# EAGLE design balise réceptrice - partie filtrage (EAGLE 6.3)
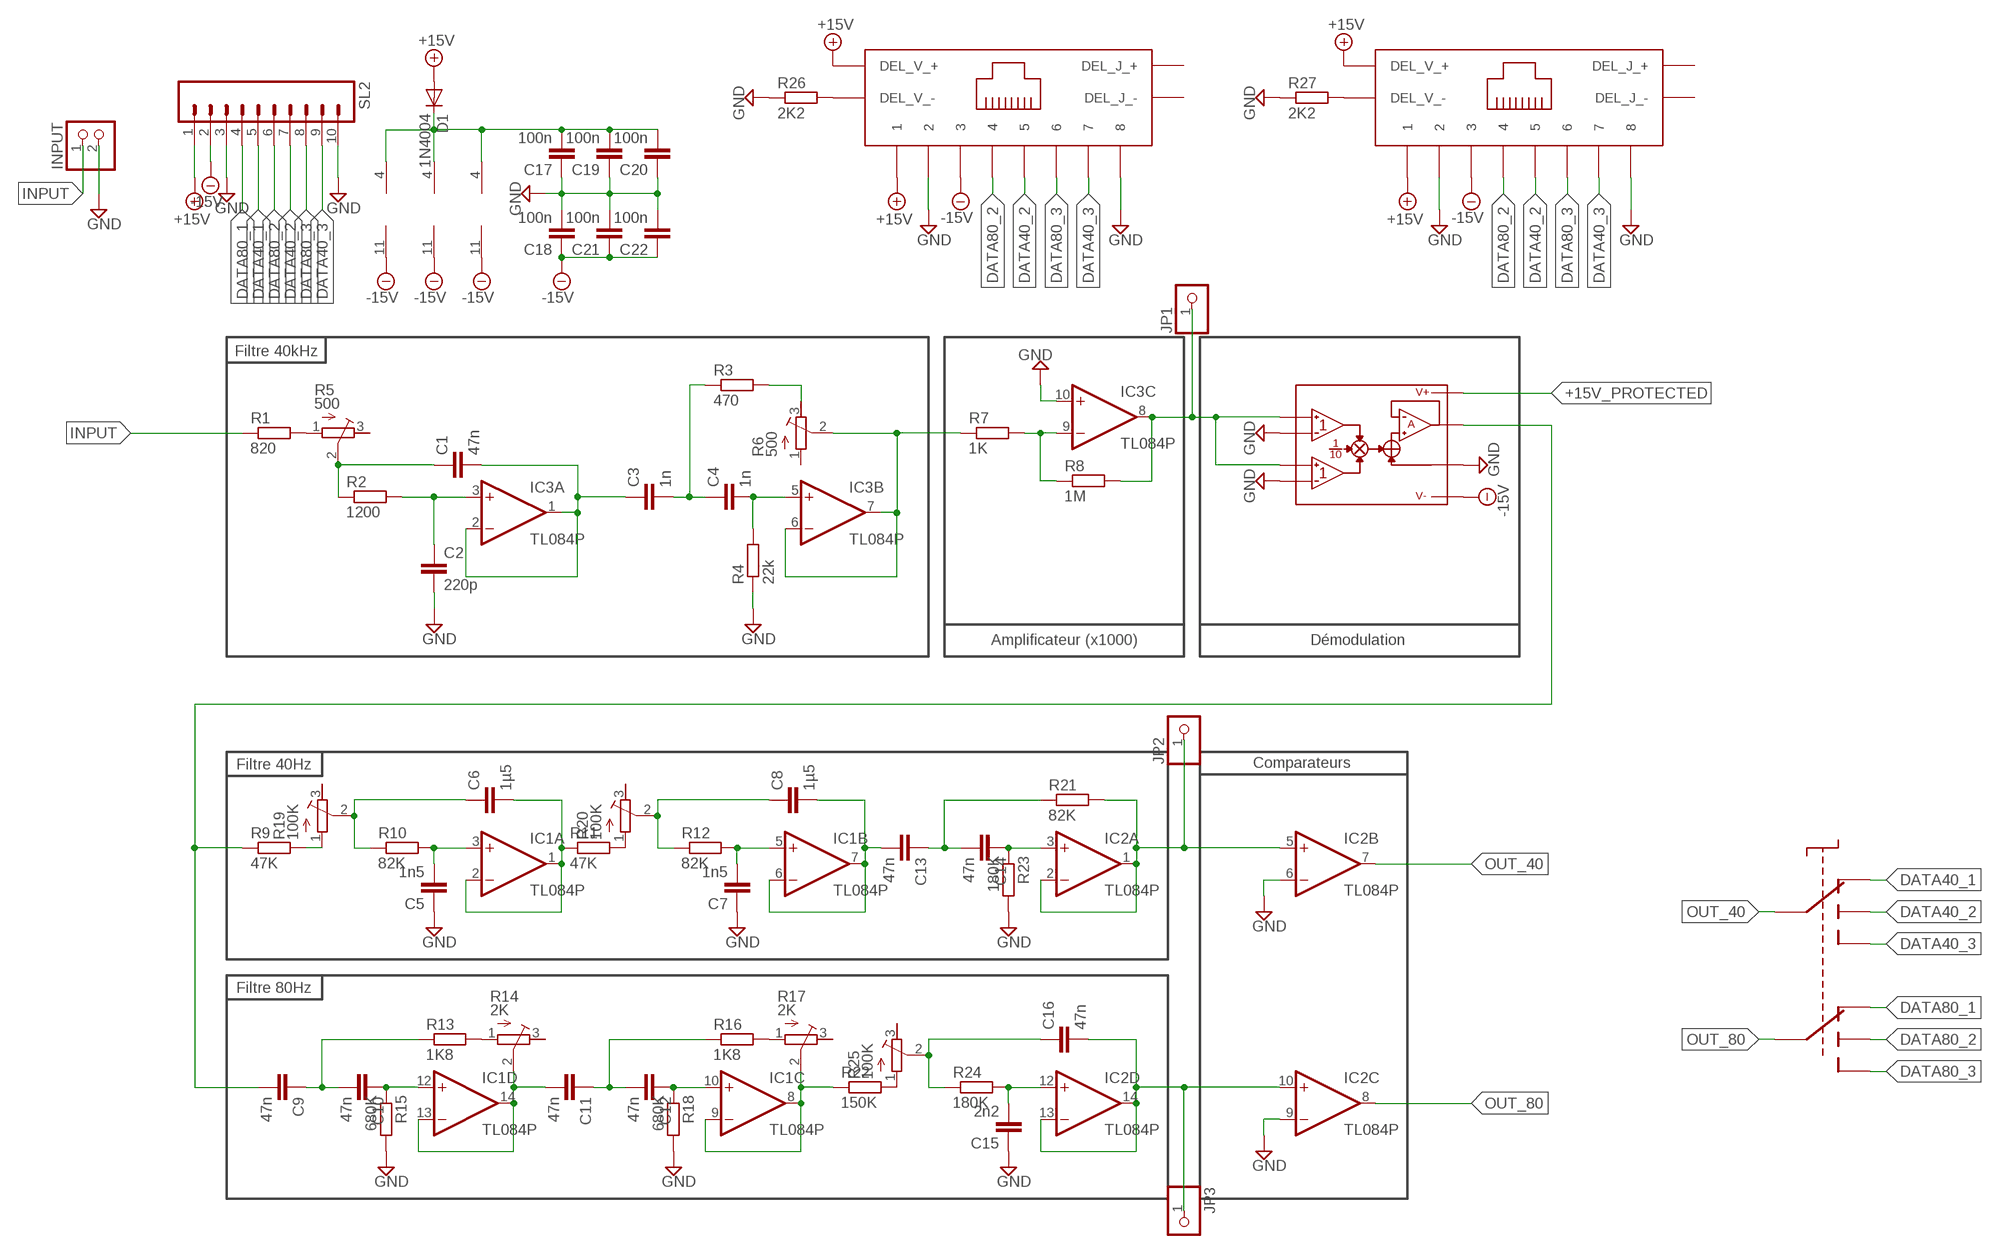
[diagram p0: schematic, sheet 1]

## Parts
C1  47n  C-EU050-024X044  [C050-024X044]
C2  220p  C-EU050-024X044  [C050-024X044]
C3  1n  C-EU050-024X044  [C050-024X044]
C4  1n  C-EU050-024X044  [C050-024X044]
C5  1n5  C-EU050-024X044  [C050-024X044]
C6  1µ5  C-EU150-091X182  [C150-091X182]
C7  1n5  C-EU050-024X044  [C050-024X044]
C8  1µ5  C-EU150-091X182  [C150-091X182]
C9  47n  C-EU050-024X044  [C050-024X044]
C10  47n  C-EU050-024X044  [C050-024X044]
C11  47n  C-EU050-024X044  [C050-024X044]
C12  47n  C-EU050-024X044  [C050-024X044]
C13  47n  C-EU050-024X044  [C050-024X044]
C14  47n  C-EU050-024X044  [C050-024X044]
C15  2n2  C-EU050-024X044  [C050-024X044]
C16  47n  C-EU050-024X044  [C050-024X044]
C17  100n  C-EU050-024X044  [C050-024X044]
C18  100n  C-EU050-024X044  [C050-024X044]
C19  100n  C-EU050-024X044  [C050-024X044]
C20  100n  C-EU050-024X044  [C050-024X044]
C21  100n  C-EU050-024X044  [C050-024X044]
C22  100n  C-EU050-024X044  [C050-024X044]
D1  1N4004  [DO41-10]
IC1  TL084P  [DIL14]
IC2  TL084P  [DIL14]
IC3  TL084P  [DIL14]
INPUT  PINHD-1X2  [1X02]
JP1  PINHD-1X1  [1X01]
JP2  PINHD-1X1  [1X01]
JP3  PINHD-1X1  [1X01]
R1  820  R-EU_0207/2V  [0207/2V]
R2  1200  R-EU_0207/2V  [0207/2V]
R3  470  R-EU_0207/2V  [0207/2V]
R4  22k  R-EU_0207/2V  [0207/2V]
R5  500  R-TRIMM3339P  [RTRIM3339P]
R6  500  R-TRIMM3339P  [RTRIM3339P]
R7  1K  R-EU_0204/7  [0204/7]
R8  1M  R-EU_0204/7  [0204/7]
R9  47K  R-EU_0204/7  [0204/7]
R10  82K  R-EU_0204/7  [0204/7]
R11  47K  R-EU_0207/2V  [0207/2V]
R12  82K  R-EU_0207/2V  [0207/2V]
R13  1K8  R-EU_0207/2V  [0207/2V]
R14  2K  R-TRIMM3339P  [RTRIM3339P]
R15  680K  R-EU_0207/2V  [0207/2V]
R16  1K8  R-EU_0207/2V  [0207/2V]
R17  2K  R-TRIMM3339P  [RTRIM3339P]
R18  680K  R-EU_0207/2V  [0207/2V]
R19  100K  R-TRIMM3339P  [RTRIM3339P]
R20  100K  R-TRIMM3339P  [RTRIM3339P]
R21  82K  R-EU_0207/2V  [0207/2V]
R22  150K  R-EU_0207/2V  [0207/2V]
R23  180K  R-EU_0207/2V  [0207/2V]
R24  180K  R-EU_0207/2V  [0207/2V]
R25  100K  R-TRIMM3339P  [RTRIM3339P]
R26  2K2  R-EU_0207/2V  [0207/2V]
R27  2K2  R-EU_0207/2V  [0207/2V]
SL2  M10  [10P]
U$1  AD633JN  [DIL08]
U$2  RJ45_FEMELLE  [RJ45_FEMELLE]
U$3  RJ45_FEMELLE  [RJ45_FEMELLE]
U$4  SWITCH_DP3T_SP112  [SWITCH_SP112]

## Nets
+15V: D1.A SL2.1 U$2.1 U$2.DEL_V_+ U$3.1 U$3.DEL_V_+
+15V_PROTECTED: C17.2 C19.2 C20.2 D1.C IC1.4(P:V+) IC2.4(P:V+) IC3.4(P:V+) U$1.8(+V)
-15V: C18.1 C21.1 C22.1 IC1.11(P:V-) IC2.11(P:V-) IC3.11(P:V-) SL2.2 U$1.5(-V) U$2.3 U$3.3
DATA40_1: SL2.5 U$4.1A
DATA40_2: SL2.7 U$2.5 U$3.5 U$4.1B
DATA40_3: SL2.9 U$2.7 U$3.7 U$4.1C
DATA80_1: SL2.4 U$4.2A
DATA80_2: SL2.6 U$2.4 U$3.4 U$4.2B
DATA80_3: SL2.8 U$2.6 U$3.6 U$4.2C
GND: C2.2 C5.1 C7.1 C15.1 C17.1 C18.2 C19.1 C20.1 C21.2 C22.2 IC2.6(B:-IN) IC2.9(C:-IN) IC3.10(C:+IN) INPUT.2 R4.1 R15.2 R18.2 R23.2 R26.1 R27.1 SL2.3 SL2.10 U$1.2(X2) U$1.4(Y2) U$1.6(Z) U$2.2 U$2.8 U$3.2 U$3.8
INPUT: INPUT.1 R1.1
N$1: C2.1 IC3.3(A:+IN) R2.2
N$2: IC3.9(C:-IN) R7.2 R8.1
N$3: IC3.8(C:OUT) JP1.1 R8.2 U$1.1(X1) U$1.3(Y1)
N$4: R1.2 R5.1(E)
N$5: C1.1 R2.1 R5.2(S)
N$6: C1.2 C3.1 IC3.1(A:OUT) IC3.2(A:-IN)
N$7: C3.2 C4.1 R3.1
N$8: C4.2 IC3.5(B:+IN) R4.2
N$9: IC3.6(B:-IN) IC3.7(B:OUT) R6.2(S) R7.1
N$10: R3.2 R6.3(A)
N$11: R26.2 U$2.DEL_V_-
N$12: C6.1 R10.1 R19.2(S)
N$13: C5.2 IC1.3(A:+IN) R10.2
N$14: C6.2 IC1.1(A:OUT) IC1.2(A:-IN) R11.1
N$15: R13.2 R14.1(E)
N$16: C8.1 R12.1 R20.2(S)
N$17: C7.2 IC1.5(B:+IN) R12.2
N$18: C8.2 C13.2 IC1.6(B:-IN) IC1.7(B:OUT)
N$19: C9.1 C10.2 R13.1
N$20: C11.2 IC1.13(D:-IN) IC1.14(D:OUT) R14.2(S)
N$21: C10.1 IC1.12(D:+IN) R15.1
N$22: R16.2 R17.1(E)
N$23: C11.1 C12.2 R16.1
N$24: IC1.8(C:OUT) IC1.9(C:-IN) R17.2(S) R22.1
N$25: C12.1 IC1.10(C:+IN) R18.1
N$26: C9.2 R9.1 U$1.7(W)
N$27: R9.2 R19.1(E)
N$28: R11.2 R20.1(E)
N$29: C16.1 R24.1 R25.2(S)
N$30: C15.2 IC2.12(D:+IN) R24.2
N$31: C13.1 C14.2 R21.1
N$32: IC2.1(A:OUT) IC2.2(A:-IN) IC2.5(B:+IN) JP2.1 R21.2
N$33: C14.1 IC2.3(A:+IN) R23.1
N$34: C16.2 IC2.10(C:+IN) IC2.13(D:-IN) IC2.14(D:OUT) JP3.1
N$35: R22.2 R25.1(E)
N$36: R27.2 U$3.DEL_V_-
OUT_40: IC2.7(B:OUT) U$4.COM_1(COM1)
OUT_80: IC2.8(C:OUT) U$4.COM_2(COM2)
Unconnected: IC3.12(D:+IN) IC3.13(D:-IN) IC3.14(D:OUT) R5.3(A) R6.1(E) R14.3(A) R17.3(A) R19.3(A) R20.3(A) R25.3(A) U$2.DEL_J_+ U$2.DEL_J_- U$3.DEL_J_+ U$3.DEL_J_-

## Notes on the sheet
- Filtre 40kHz
- Amplificateur (x1000) | Démodulation
- Filtre 40Hz | Comparateurs
- Filtre 80Hz

## Library data of the parts
C1 C3-C22 = resistor:C-EU: CAPACITOR, European symbol; OC_FARNELL: unknown
C2 = resistor:C-EU: CAPACITOR, European symbol; MF: SUSUMU; MPN: RR1220P-104-B-T5; OC_FARNELL: 1653285
D1 = diode:1N4004: DIODE general purpose rectifier, 1 A; OC_FARNELL: unknown
IC1-IC3 = linear:TL084: OP AMP; OC_FARNELL: unknown
INPUT = pinhead:PINHD-1X2: PIN HEADER; OC_FARNELL: unknown
JP1-JP3 = pinhead:PINHD-1X1: PIN HEADER; OC_FARNELL: unknown
R1-R4 R7-R13 R15 R16 R18 R21-R24 R26 R27 = resistor:R-EU_: RESISTOR, European symbol; OC_FARNELL: unknown
R5 R6 R14 R17 R19 R20 R25 = resistor:R-TRIMM: Trimm resistor; OC_FARNELL: unknown
SL2 = con-amp-quick:M10: AMP QUICK CONNECTOR; OC_FARNELL: unknown; OC_NEWARK: unknown
U$1 = analog-devices:AD633JN; OC_FARNELL: unknown
U$2 U$3 = libINTech-Balise:RJ45_FEMELLE; OC_FARNELL: unknown
U$4 = libINTech-Balise:SWITCH_DP3T_SP112; OC_FARNELL: unknown

## Board
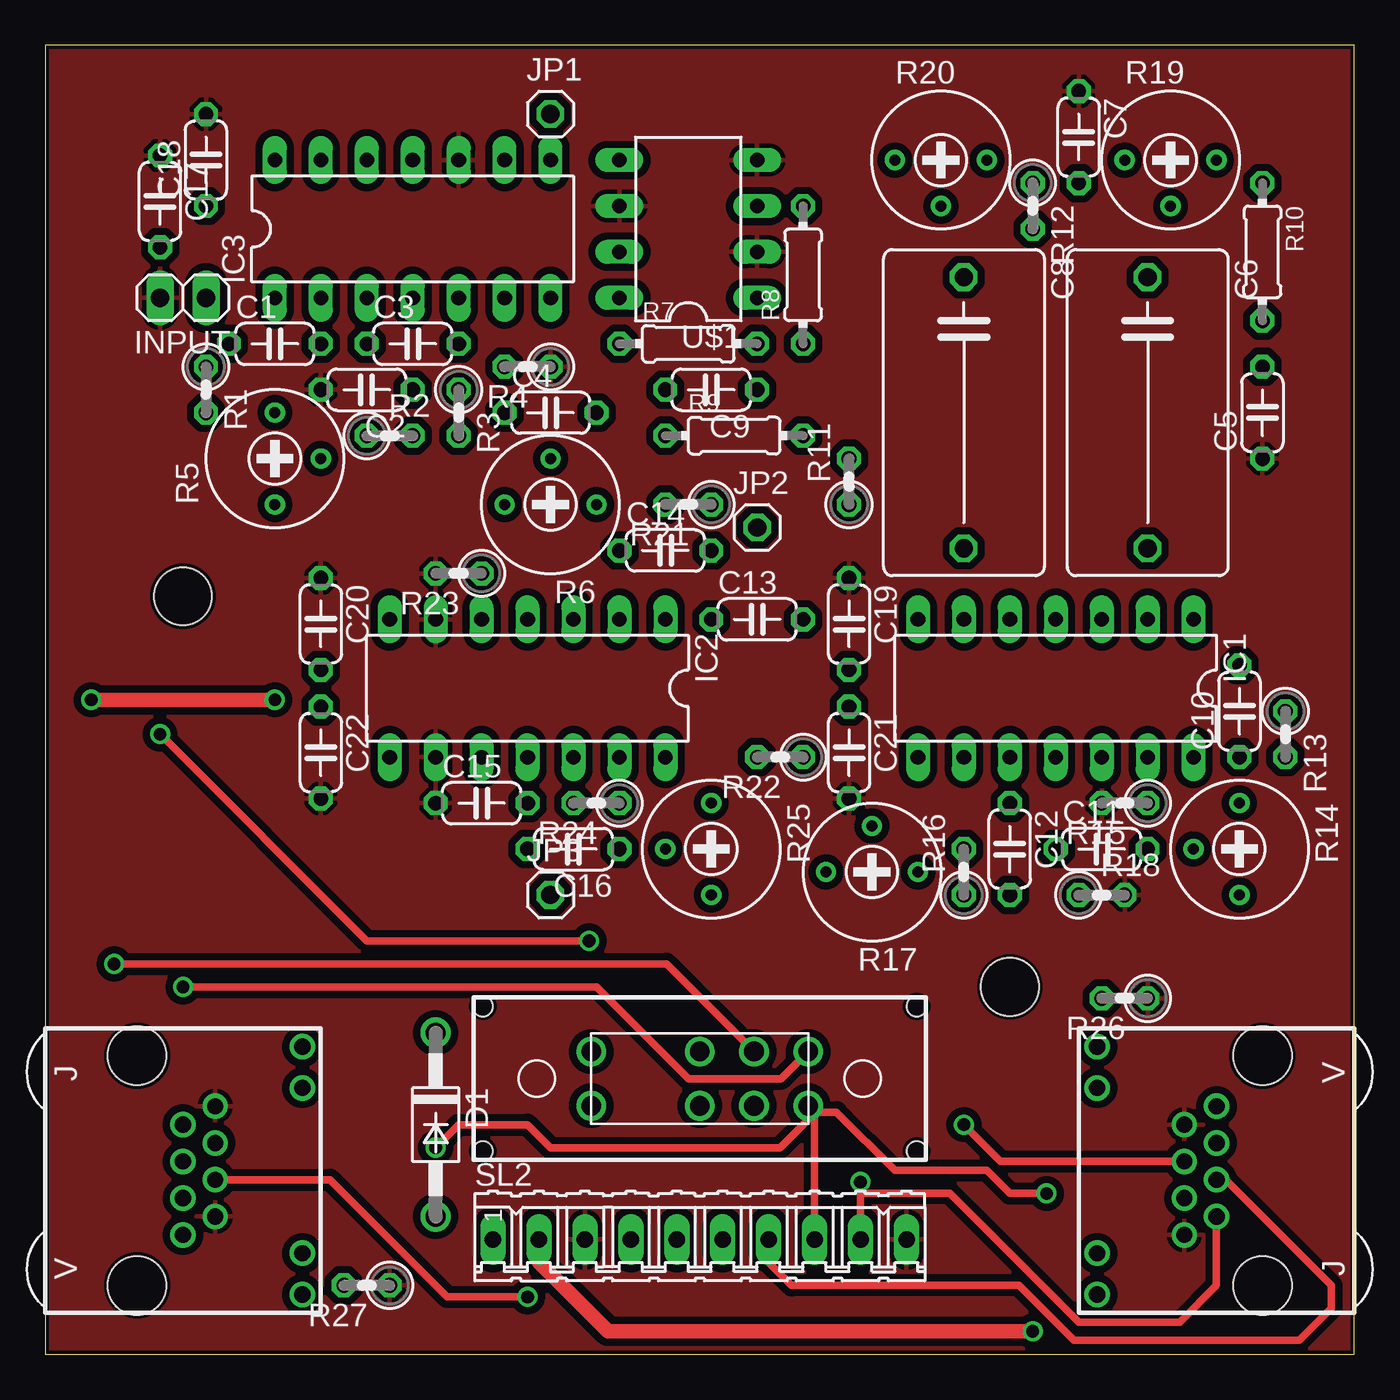
[diagram p1: board, top side]
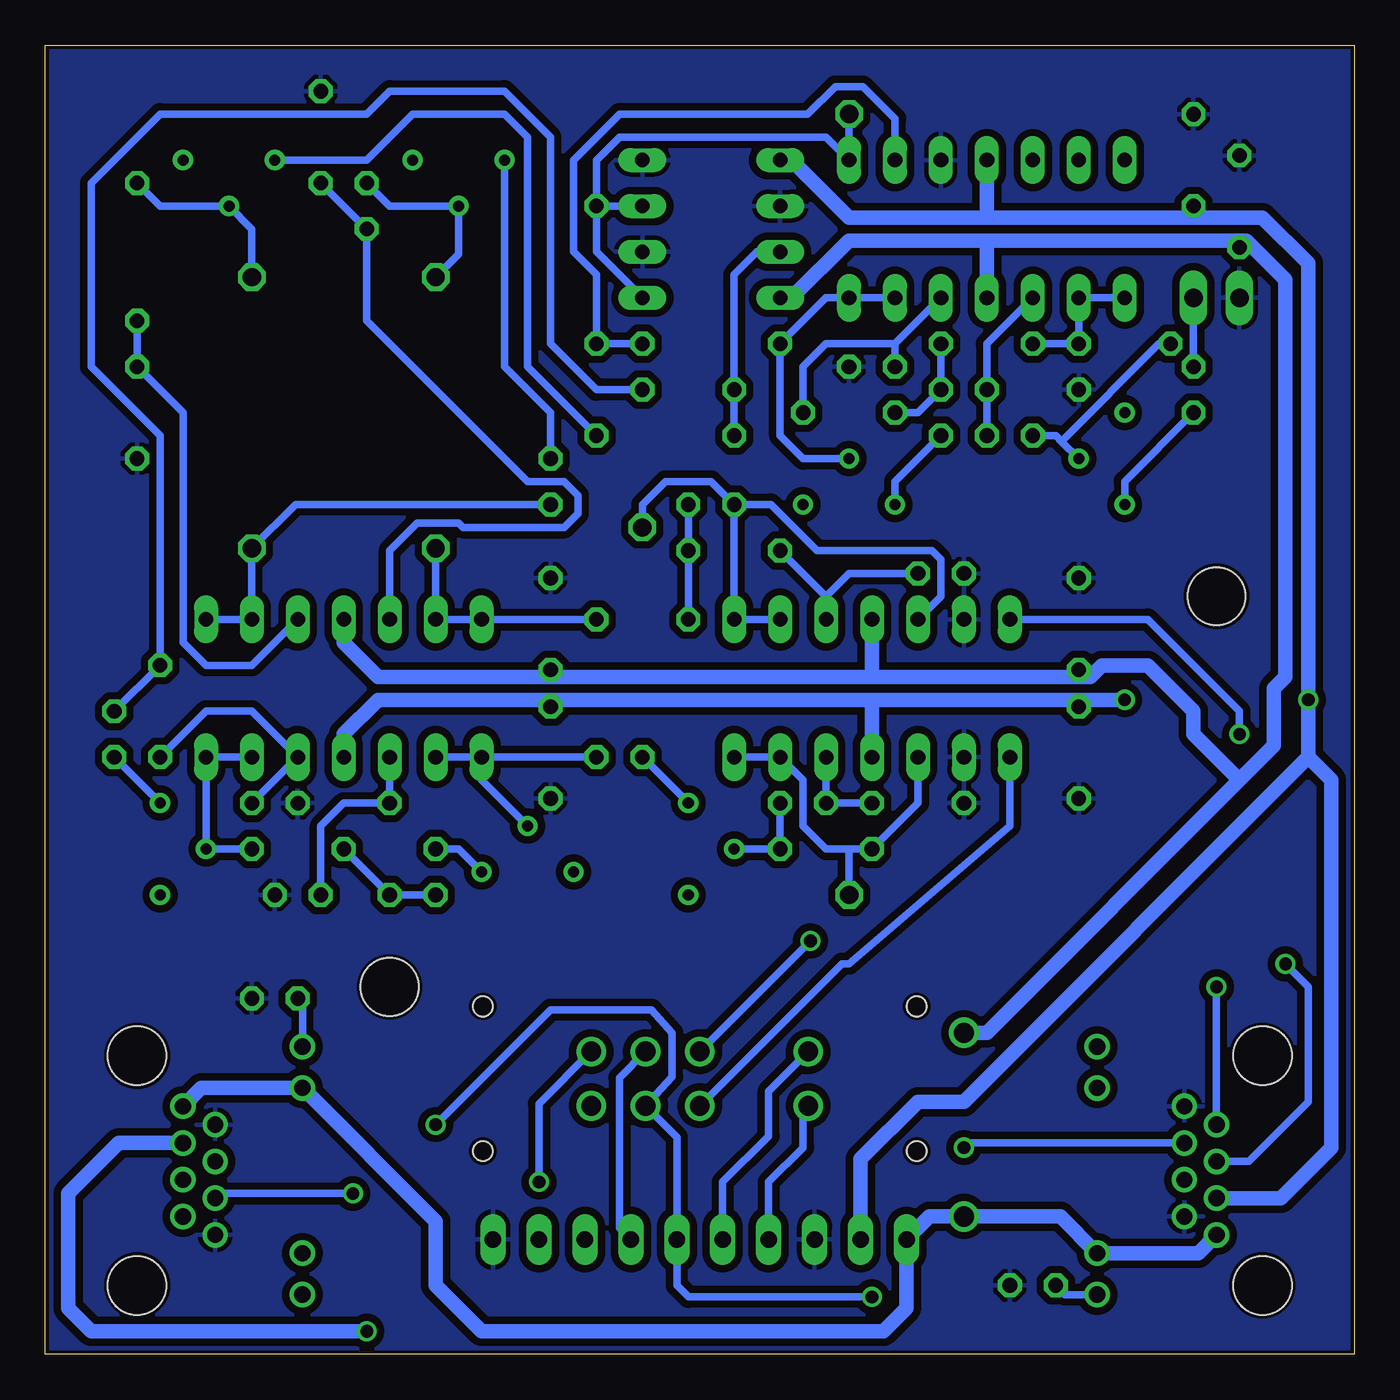
[diagram p2: board, bottom side, seen from below]

Size 72.39 x 72.39 mm. Coordinates in mm from the lower left corner, seen from the top.
Outline: 0,0 72.39,0 72.39,72.39 0,72.39 0,0
Copper layers (1*16): Top 0.035mm / dielectric 1.5mm / Bottom 0.035mm
Design rules "default *": minimum track width 10mil, minimum drill 24mil, track to track 16mil, track to pad 16mil, pad to pad 16mil, via to via 16mil, smd to smd 16mil, copper to edge 8mil, drill to drill 8mil, minimum pad ring 10mil, minimum via ring 8mil, stop-mask expansion 4mil, vias tented up to drill 0mil, thermal gap 10mil
Holes 3.2 mm at 7.62,41.91 53.34,20.32

### Footprints (pad centres in the part's own frame; a part is rotated, then mirrored left to right if it is on the bottom)
C050-024X044 = drill 0.813 octagon: 1 -2.54,0; 2 2.54,0
C150-091X182 = drill 1.016 octagon: 1 -7.493,0; 2 7.493,0
DO41-10 = drill 1.118: A 5.08,0; C -5.08,0
DIL14 = drill 0.813 long: 1 -7.62,-3.81; 2 -5.08,-3.81; 3 -2.54,-3.81; 4 0,-3.81; 5 2.54,-3.81; 6 5.08,-3.81; 7 7.62,-3.81; 8 7.62,3.81; 9 5.08,3.81; 10 2.54,3.81; 11 0,3.81; 12 -2.54,3.81; 13 -5.08,3.81; 14 -7.62,3.81
1X02 = drill 1.016 long: 1 -1.27,0; 2 1.27,0
1X01 = drill 1.016 octagon: 1 0,0
0207/2V = drill 0.813 octagon: 1 -1.27,0; 2 1.27,0
RTRIM3339P = drill 0.61: 1 -2.54,0; 2 0,-2.54; 3 2.54,0
0204/7 = drill 0.813 octagon: 1 -3.81,0; 2 3.81,0
10P = drill 0.914 long: 1 -11.43,0; 2 -8.89,0; 3 -6.35,0; 4 -3.81,0; 5 -1.27,0; 6 1.27,0; 7 3.81,0; 8 6.35,0; 9 8.89,0; 10 11.43,0
DIL08 = drill 0.813 long: 1 -3.81,-3.81; 2 -1.27,-3.81; 3 1.27,-3.81; 4 3.81,-3.81; 5 3.81,3.81; 6 1.27,3.81; 7 -1.27,3.81; 8 -3.81,3.81
RJ45_FEMELLE = drill 0.9: 1 3.556,2.54; 2 2.54,4.318; 3 1.524,2.54; 4 0.508,4.318; 5 -0.508,2.54; 6 -1.524,4.318; 7 -2.54,2.54; 8 -3.556,4.318; DEL_J_+ -6.858,9.144; DEL_J_- -4.572,9.144; DEL_V_+ 4.572,9.144; DEL_V_- 6.858,9.144 | hole 3.25: -6.35,0; 6.35,0
SWITCH_SP112 = drill 1.1: 1A -6,1.5; 1B 3,1.5; 1C 6,1.5; 2A -6,-1.5; 2B 3,-1.5; 2C 6,-1.5; COM_1 0,1.5; COM_2 0,-1.5 | hole 1.1: -12,4; -12,-4; 12,-4; 12,4

### Placement (x,y rotation side)
C1  12.7,55.88 0 top
C2  17.78,53.34 180 top
C3  20.32,55.88 0 top
C4  27.94,52.07 0 top
C5  67.31,52.07 90 top
C6  60.96,52.07 270 top
C7  57.15,67.31 270 top
C8  50.8,52.07 270 top
C9  36.83,53.34 180 top
C10  66.04,35.56 90 top
C11  58.42,27.94 0 top
C12  53.34,27.94 270 top
C13  39.37,40.64 0 top
C14  34.29,44.45 0 top
C15  24.13,30.48 0 top
C16  29.21,27.94 180 top
C17  6.35,63.75 270 top
C18  8.89,66.04 90 top
C19  44.45,40.39 270 top
C20  15.24,40.39 270 top
C21  44.45,33.27 270 top
C22  15.24,33.27 270 top
D1  21.59,12.7 270 top
IC1  55.88,36.83 180 top
IC2  26.67,36.83 180 top
IC3  20.32,62.23 0 top
INPUT  7.62,58.42 180 top
JP1  27.94,68.58 0 top
JP2  39.37,45.72 0 top
JP3  27.94,25.4 0 top
R1  8.89,53.34 270 top
R2  19.05,50.8 0 top
R3  22.86,52.07 270 top
R4  26.67,54.61 180 top
R5  12.7,49.53 90 top
R6  27.94,46.99 180 top
R7  35.56,55.88 0 top
R8  41.91,59.69 90 top
R9  38.1,50.8 0 top
R10  67.31,60.96 270 top
R11  44.45,48.26 90 top
R12  54.61,63.5 270 top
R13  68.58,34.29 270 top
R14  66.04,27.94 270 top
R15  59.69,30.48 180 top
R16  50.8,26.67 90 top
R17  45.72,26.67 180 top
R18  58.42,25.4 0 top
R19  62.23,66.04 0 top
R20  49.53,66.04 0 top
R21  35.56,46.99 180 top
R22  40.64,33.02 180 top
R23  22.86,43.18 180 top
R24  30.48,30.48 180 top
R25  36.83,27.94 270 top
R26  59.69,19.68 180 top
R27  17.78,3.81 180 top
SL2  36.2,6.35 0 top
U$1  35.56,62.23 90 top
U$2  67.31,10.16 90 top
U$3  5.08,10.16 270 top
U$4  36.2,15.24 0 top

### Tracks (layer width: path | path; a pad name or v marks a point on that pad's centre or on a via)
+15V
  Bottom 0.813: U$3.1 8.64,5.59 U$3.DEL_V_+ 16.26,7.62 D1.A 23.5,7.62 SL2.1 24.77,2.54 26.04,1.27 48.26,1.27 50.8,3.81 50.8,7.37 U$2.DEL_V_+ 63.75,14.73 U$2.1
+15V_PROTECTED
  Bottom 0.813: D1.C 20.32,17.78 6.35,31.75 | 6.35,61.59 5.97,61.59 3.81,59.44 3.81,37.47 4.45,36.83 4.45,33.66 6.35,31.75 | 6.35,61.59 20.32,61.59 | 20.32,61.59 27.94,61.59 31.11,58.42 U$1.8 | IC3.4 20.32,61.59 | C17.2 6.35,61.59 | IC2.4 26.67,37.47 | 26.67,37.47 44.45,37.47 | 44.45,37.47 53.98,37.47 55.88,39.37 IC1.4 | C19.2 44.45,37.47 | 26.67,37.47 15.24,37.47 | 15.24,37.47 14.61,37.47 13.97,38.1 11.43,38.1 8.89,35.56 8.89,34.29 6.35,31.75 | C20.2 15.24,37.47
-15V  (via drill 0.7)
  Top 0.813: v12.7,36.2 v2.54,36.2 | v54.61,1.27 31.11,1.27 27.3,5.08 SL2.2
  Bottom 0.813: IC3.11 20.32,62.87 | 20.32,62.87 8.89,62.87 | 8.89,62.87 5.08,62.87 2.54,60.33 v2.54,36.2 2.54,33.02 | 20.32,62.87 27.94,62.87 31.11,66.04 U$1.5 | C18.1 8.89,62.87 | IC1.11 55.88,34.29 53.98,36.2 44.45,36.2 | C21.1 44.45,36.2 | 44.45,36.2 26.67,36.2 | 26.67,36.2 IC2.11 | 26.67,36.2 15.24,36.2 | 2.54,33.02 21.59,13.97 24.13,13.97 27.3,10.79 SL2.2 | U$3.3 4.06,8.64 1.27,11.43 1.27,31.75 2.54,33.02 | C22.1 15.24,36.2 | 15.24,36.2 v12.7,36.2 | U$2.3 68.33,11.68 71.12,8.89 71.12,2.54 69.85,1.27 v54.61,1.27
DATA40_1
  Bottom 0.406: U$4.1A 32.38,14.55 32.38,12.06 34.92,9.53 SL2.5
DATA40_2  (via drill 0.7)
  Top 0.406: v3.81,21.59 34.34,21.59 U$4.1B | U$2.5 65.28,9.65 71.12,3.81 71.12,2.54 69.34,0.76 56.9,0.76 53.85,3.81 41.27,3.81 40.01,5.08 SL2.7
  Bottom 0.406: U$4.1B 40.64,15.29 40.64,6.99 SL2.7 | U$3.5 5.84,10.67 2.54,13.97 2.54,20.32 v3.81,21.59
DATA40_3  (via drill 0.7)
  Top 0.406: v7.62,20.32 30.48,20.32 35.56,15.24 40.7,15.24 U$4.1C | U$2.7 64.77,3.81 62.74,1.78 57.15,1.78 50.04,8.89 45.09,8.89 | 45.09,8.89 SL2.9 | v45.09,9.53 45.09,8.89
  Bottom 0.406: U$3.7 v7.62,20.32 | U$4.1C 45.09,13.85 v45.09,9.53
DATA80_1
  Bottom 0.406: U$4.2A 30.48,13.46 30.48,11.43 32.38,9.53 SL2.4
DATA80_2  (via drill 0.7)
  Top 0.406: U$3.4 15.75,9.65 22.23,3.17 v26.67,3.17 | v50.8,12.7 52.83,10.67 U$2.4
  Bottom 0.406: v26.67,3.17 36.83,3.17 37.47,3.81 SL2.6 37.47,12.01 U$4.2B 37.72,15.34 37.72,17.78 38.86,19.05 44.45,19.05 v50.8,12.7
DATA80_3  (via drill 0.7)
  Top 0.406: v21.59,11.43 22.86,12.7 26.67,12.7 27.94,11.43 40.64,11.43 42.2,12.98 U$4.2C 42.55,13.39 | 42.55,13.39 SL2.8 | v55.37,8.89 53.34,8.89 52.07,10.16 46.99,10.16 43.76,13.39 42.55,13.39
  Bottom 0.406: U$3.6 21.34,11.68 v21.59,11.43 | U$2.6 62.74,8.89 v55.37,8.89
GND
  pour Bottom: 0,72.39 72.39,72.39 72.39,0 0,0
  pour Top: 0,72.39 72.39,72.39 72.39,0 0,0
INPUT
  Bottom 0.406: INPUT.1 R1.1
N$1
  Bottom 0.406: R2.2 C2.1 20.32,55.88 IC3.3
N$2
  Bottom 0.406: R7.2 R8.1 41.91,59.69 43.18,60.96 43.18,66.04 40.64,68.58 30.23,68.58 28.7,70.1 27.18,70.1 25.4,68.33 IC3.9
N$3
  Bottom 0.406: R8.2 U$1.3 | U$1.1 41.91,60.96 R8.2 | R8.2 41.91,66.04 40.64,67.31 29.21,67.31 IC3.8 JP1.1
N$4
  Bottom 0.406: R1.2 12.7,48.26 R5.1
N$5
  Bottom 0.406: R5.2 16.19,50.48 | 16.19,50.48 16.51,50.8 R2.1 | C1.1 10.79,55.88 16.19,50.48
N$6
  Bottom 0.406: IC3.1 IC3.2 C1.2 C3.1
N$7
  Bottom 0.406: C3.2 R3.1 24.13,52.07 C4.1
N$8
  Bottom 0.406: IC3.5 25.4,55.88 | 25.4,55.88 R4.2 | C4.2 30.48,54.61 29.21,55.88 25.4,55.88
N$9
  Bottom 0.406: IC3.6 IC3.7 29.21,58.42 R7.1 31.75,50.8 30.48,49.53 R6.2
N$10
  Bottom 0.406: R3.2 25.4,48.26 R6.3
N$11
  Bottom 0.406: U$2.DEL_V_- 58.17,19.43 R26.2
N$12
  Bottom 0.406: C6.1 60.96,62.23 R19.2 66.04,63.5 R10.1
N$13
  Bottom 0.406: R10.2 C5.2 64.77,52.07 64.77,39.37 63.5,38.1 60.96,38.1 IC1.3
N$14
  Bottom 0.406: IC1.1 IC1.2 C6.2 58.55,46.99 R11.1
N$15
  Bottom 0.406: R13.2 R14.1
N$16
  Bottom 0.406: R12.1 53.34,63.5 R20.2 49.53,60.83 C8.1
N$17
  Bottom 0.406: C7.2 R12.2 54.61,57.15 45.72,48.26 43.69,48.26 42.93,47.5 42.93,46.48 43.69,45.72 49.28,45.72 49.53,45.97 51.82,45.97 53.34,44.45 IC1.5
N$18
  Bottom 0.406: C8.2 IC1.6 IC1.7 C13.2
N$19
  Bottom 0.406: R13.1 C10.2 66.04,50.8 69.85,54.61 69.85,64.77 66.04,68.58 54.61,68.58 53.34,69.85 46.99,69.85 44.45,67.31 44.45,55.88 41.91,53.34 C9.1
N$20
  Bottom 0.406: IC1.13 IC1.14 R14.2 C11.2
N$21
  Bottom 0.406: R15.1 IC1.12 60.96,35.56 63.5,35.56 C10.1
N$22
  Bottom 0.406: R16.2 49.53,27.94 R17.1
N$23
  Bottom 0.406: C11.1 C12.2 R16.1
N$24
  Bottom 0.406: R17.2 48.26,31.75 IC1.8 | IC1.8 IC1.9 | R22.1 IC1.8
N$25
  Bottom 0.406: R18.1 57.15,29.21 55.88,30.48 C12.1 IC1.10
N$26
  Bottom 0.406: U$1.7 33.02,60.96 34.29,59.69 C9.2 R9.1
N$27
  Bottom 0.406: R9.2 45.72,54.61 45.72,67.31 46.99,68.58 52.07,68.58 54.61,66.04 R19.1
N$28
  Bottom 0.406: R11.2 44.45,52.07 46.99,54.61 R20.1
N$29
  Bottom 0.406: R25.2 C16.1 R24.1
N$30
  Bottom 0.406: IC2.12 R24.2 C15.2
N$31
  Bottom 0.406: C13.1 C14.2 R21.1
N$32
  Bottom 0.406: IC2.2 IC2.1 R21.2 | R21.2 32.26,46.99 29.72,44.45 23.37,44.45 22.86,43.94 22.86,41.91 IC2.5 | R21.2 35.56,48.26 38.1,48.26 39.37,46.99 JP2.1
N$33
  Bottom 0.406: C14.1 29.21,41.91 | 29.21,41.91 IC2.3 | R23.1 27.94,43.18 29.21,41.91
N$34
  Bottom 0.406: IC2.14 IC2.13 30.48,31.75 30.48,29.21 29.21,27.94 27.94,27.94 | 27.94,27.94 C16.2 24.13,30.48 IC2.10 | JP3.1 27.94,27.94
N$35
  Bottom 0.406: R22.2 R25.1
N$36
  Bottom 0.406: U$3.DEL_V_- 16,3.3 R27.2
OUT_40  (via drill 0.7)
  Top 0.406: v6.35,34.29 17.78,22.86 v30.07,22.86
  Bottom 0.406: IC2.7 11.43,40.64 6.35,35.56 v6.35,34.29 | v30.07,22.86 U$4.COM_1
OUT_80
  Bottom 0.406: IC2.8 19.05,29.21 27.94,21.59 28.34,21.59 U$4.COM_2